# EasyEDA schematic PCB_MINI_FB_ACS_V1.json
TITLE: Sheet_1; REV: 1.0; Date: 2022-08-13; Sheet: 1/1; Drawn By: fuzzy2; Company: Your Company
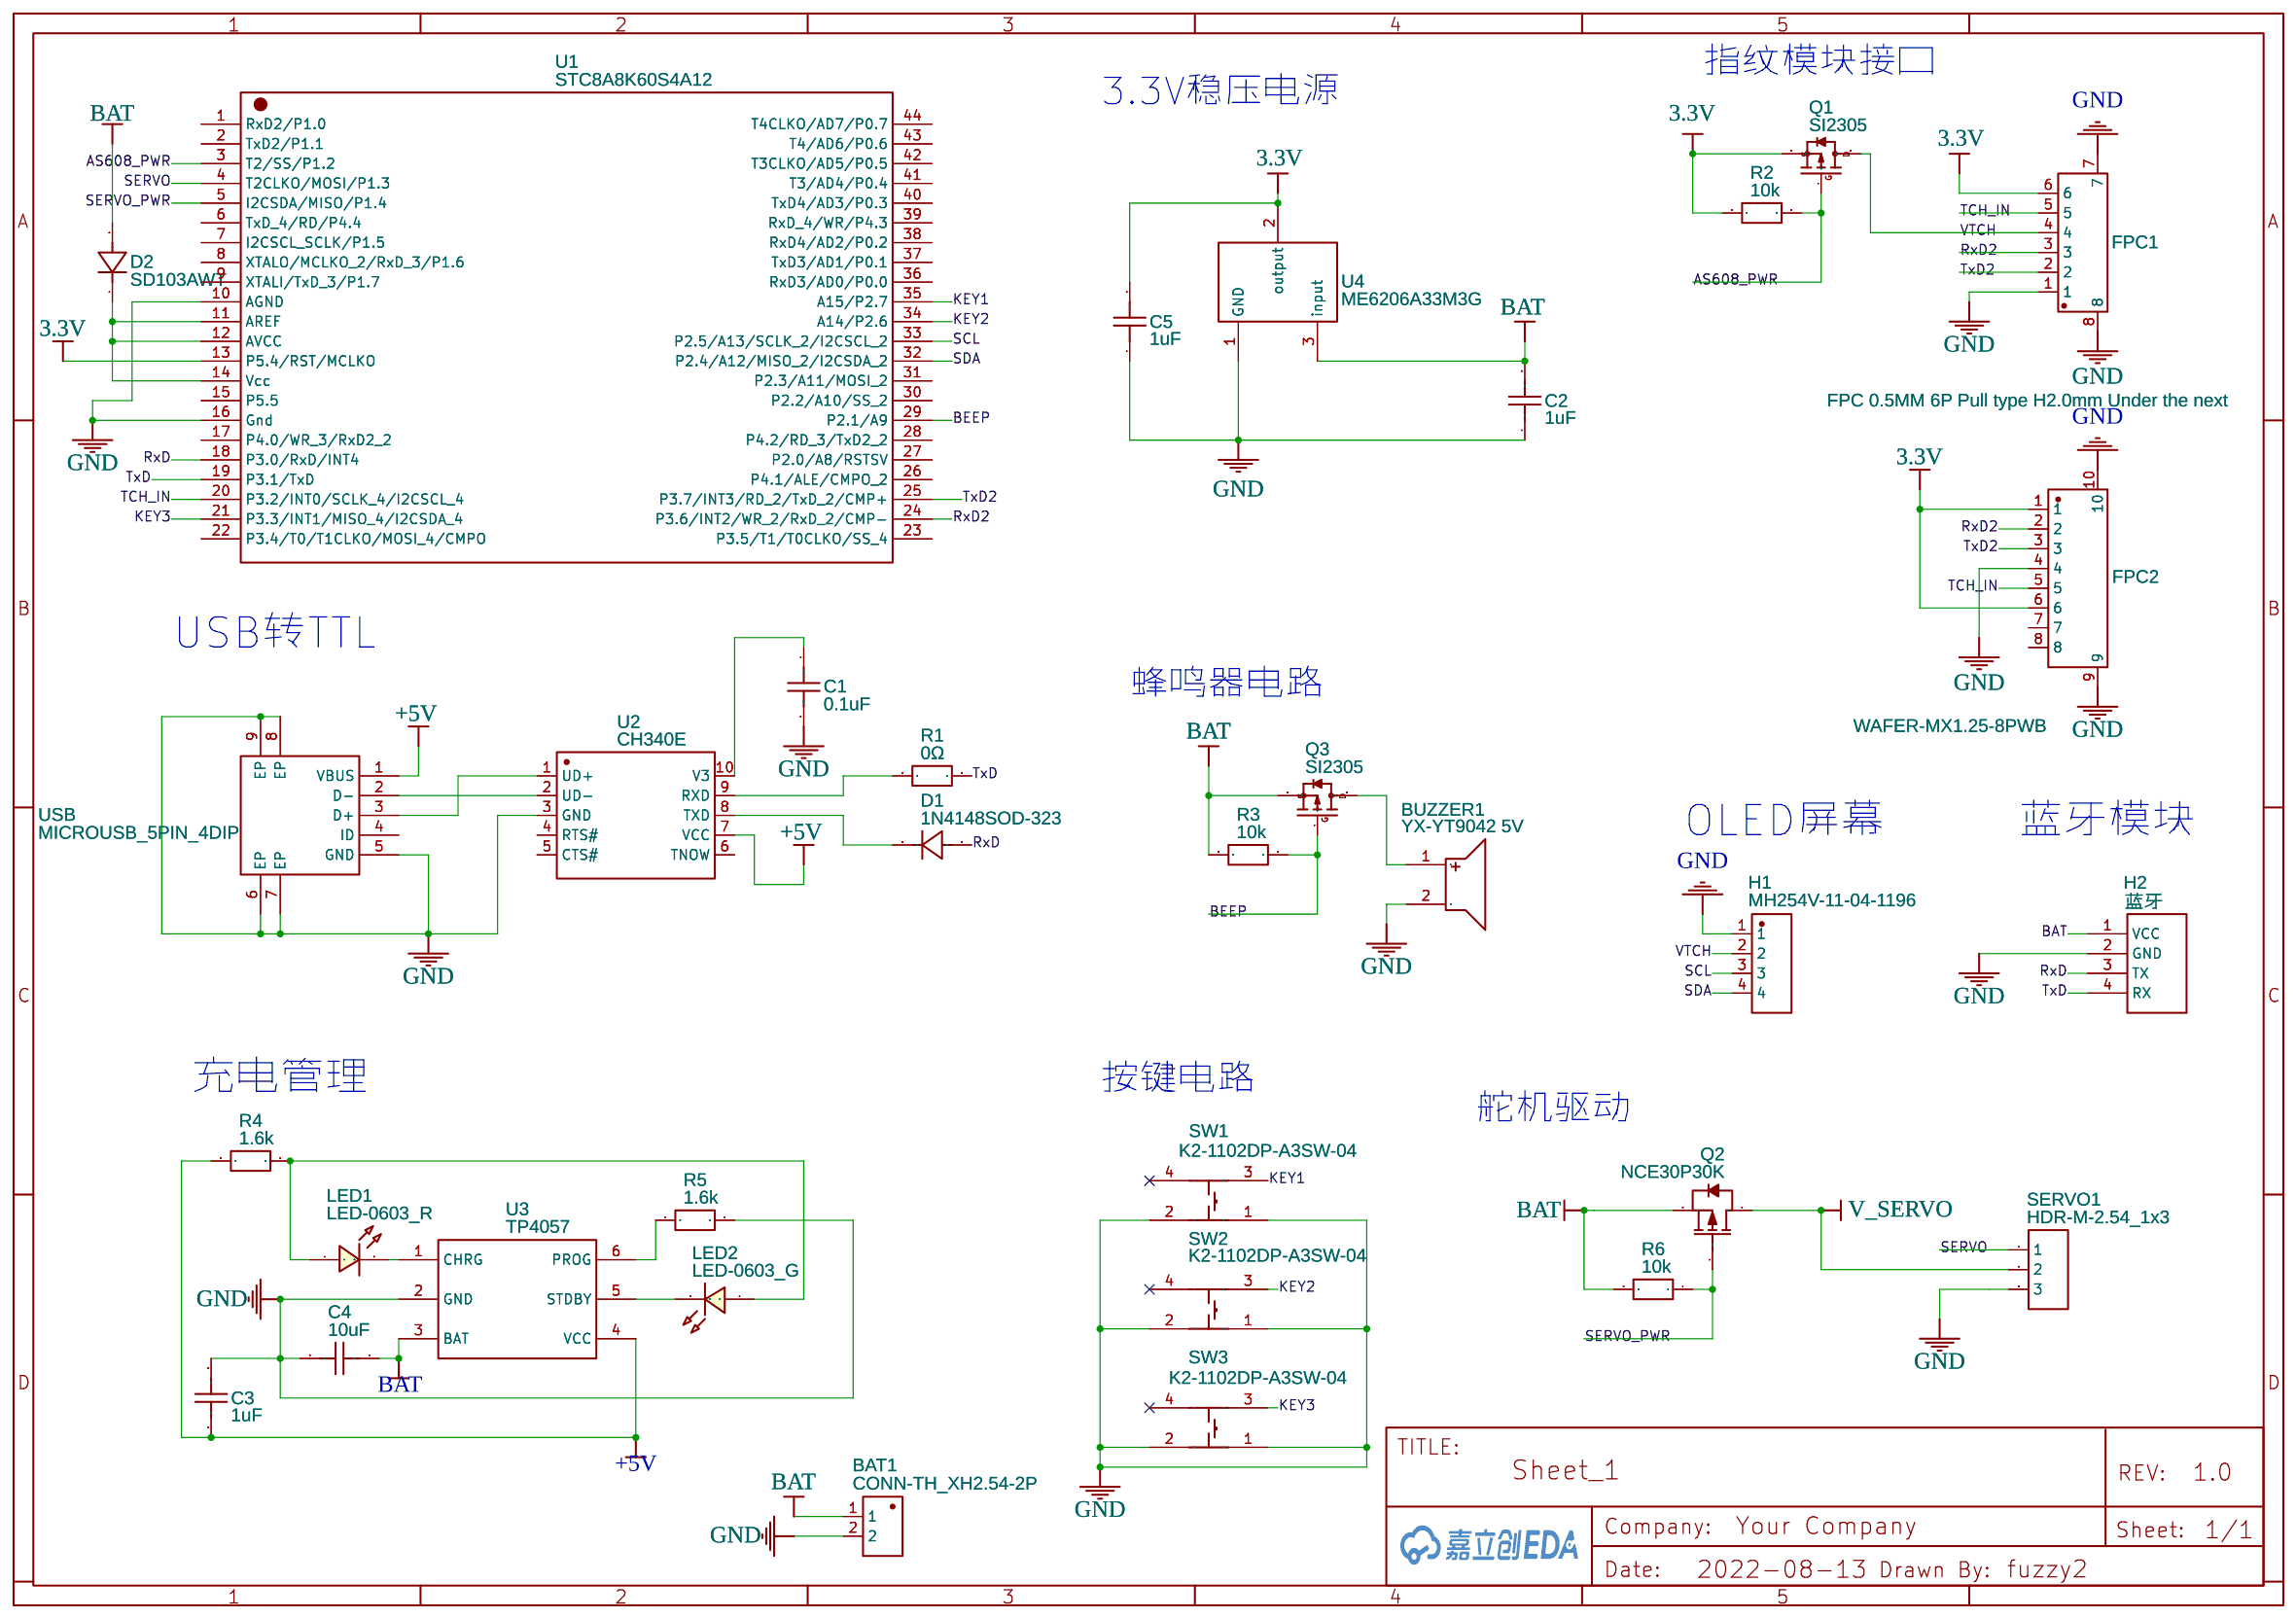
[diagram p0: schematic sheet]

## Parts
BAT1  CONN-TH_XH2.54-2P  [CONN-TH_XH2.54-2P]
BUZZER1  YX-YT9042 5V  [BUZ-TH_BD9.0-P5.00-D0.6-FD]
C1  0.1uF  [C0603]
C2  1uF  [C0603]
C3  1uF  [C0603]
C4  10uF  [C0603]
C5  1uF  [C0603]
D1  1N4148SOD-323  [SOD-323_L1.7-W1.3-LS2.5-RD]
D2  SD103AWT  [SOD-523_L1.2-W0.8-LS1.6-RD]
FPC1  FPC 0.5MM 6P Pull type H2.0mm Under the next  [FPC-SMD_P0.50-6P_LSSJ-H2.0-6P]
FPC2  WAFER-MX1.25-8PWB  [CONN-SMD_8P-P1.25_XUNPU_WAFER-MX1.25-8PWB]
H1  MH254V-11-04-1196  [HDR-TH_4P-P2.54-V-M]
H2  蓝牙  [DIP-1X4P2.54]
LED1  LED-0603_R  [LED0603_RED]
LED2  LED-0603_G  [LED0603_GREEN]
Q1  SI2305  [SOT-23-3_L2.9-W1.3-P1.90-LS2.4-BR]
Q2  NCE30P30K  [TO-252-2_L6.6-W6.1-P4.57-LS9.9-TL-CW]
Q3  SI2305  [SOT-23-3_L2.9-W1.3-P1.90-LS2.4-BR]
R1  0Ω  [R0603]
R2  10k  [R0603]
R3  10k  [R0603]
R4  1.6k  [R0603]
R5  1.6k  [R0603]
R6  10k  [R0603]
SERVO1  HDR-M-2.54_1x3  [HDR-M-2.54_1X3]
SW1  K2-1102DP-A3SW-04  [KEY-TH_4P-L6.0-W6.0-P4.50]
SW2  K2-1102DP-A3SW-04  [KEY-TH_4P-L6.0-W6.0-P4.50]
SW3  K2-1102DP-A3SW-04  [KEY-TH_4P-L6.0-W6.0-P4.50]
U1  STC8A8K60S4A12  [LQFP-44_L10.0-W10.0-P0.80-LS12.0-BL]
U2  CH340E  [MSOP-10_L3.0-W3.0-P0.50-LS5.0-BL]
U3  TP4057  [SOT-23-6_L2.9-W1.6-P0.95-LS2.8-BR]
U4  ME6206A33M3G  [ME6206A33M3G SOT-23(SOT-23-3)]
USB  MICROUSB_5PIN_4DIP  [MICRO-USB-SMD_U254-051N-4BH806]

## Library data of the parts
BAT1 = CONN-TH_XH2.54-2P: Supplier: LCSC; Supplier Part: C9900012767; Manufacturer: null; Manufacturer Part: HX25037-2A; JLCPCB Part Class: Extended Part; Contributor: gxxa622
BUZZER1 = YX-YT9042 5V: Supplier: LCSC; Supplier Part: C781848; Manufacturer: YUEXIN; Manufacturer Part: YX-YT9042 5v; Contributor: LCSC; JLCPCB Part Class: Extended Part
C1 = 0603BB104K500NGT: Supplier: LCSC; Supplier Part: C2168571; Manufacturer: Knowles(楼氏); Contributor: LCSC; JLCPCB Part Class: Extended Part
C2 C3 C5 = CL10A105KP8NNWC: Supplier: LCSC; Supplier Part: C307456; Manufacturer: Samsung Electro-Mechanics; Contributor: LCSC; JLCPCB Part Class: Extended Part
C4 = CL10A106MA8NRNC: Supplier: LCSC; Manufacturer: SAMSUNG; Supplier Part: C96446; JLCPCB Part Class: Extended Part
D1 = 1N4148SOD-323: Supplier: LCSC; Supplier Part: C2972761; Manufacturer: JKSEMI(金开盛); JLCPCB Part Class: Extended Part; Contributor: lcsc
D2 = SD103AWT: Supplier: LCSC; Supplier Part: C840750; Manufacturer: MDD（Microdiode Electronics）; Contributor: LCSC; JLCPCB Part Class: Extended Part
FPC1 = FPC 0.5MM 6P Pull type H2.0mm Under the next: Supplier: LCSC; Manufacturer: ReliaPro; Supplier Part: C11048; JLCPCB Part Class: Extended Part
FPC2 = WAFER-MX1.25-8PWB: Supplier: LCSC; Supplier Part: C3029365; Manufacturer: XUNPU(讯普); link: https://atta.szlcsc.com/upload/public/pdf/source/20220527/5ACBB683E384B6AD06743F272F933620.pdf; Contributor: lcsc
H1 = MH254V-11-04-1196: Supplier: LCSC; Supplier Part: C3015083; Manufacturer: XFCN(台湾兴飞); link: https://atta.szlcsc.com/upload/public/pdf/source/20220518/54992A1A2DF1C7E5202B51C2B9A2DABB.pdf; Contributor: lcsc
H2 = 蓝牙: Manufacturer: Ckmtw; Manufacturer Part: 220S-1*4P H=8.5MM Ytype Gold-plated; Contributor: RovinceZh; Supplier Part: C124413
LED1 = LED-0603_R: Manufacturer: EVERLIGHT(台湾亿光); Manufacturer Part: 19-217/R6C-AL1M2VY/3T; Supplier Part: C72044; Supplier: LCSC; Contributor: LCEDA_01
LED2 = LED-0603_G: Manufacturer: EVERLIGHT(台湾亿光); Manufacturer Part: 19-217/GHC-YR1S2/3T; Supplier Part: C72043; Supplier: LCSC; Contributor: LCEDA_Lib
Q1 Q3 = SI2305: Supplier: LCSC; Manufacturer: Hottech; Contributor: LCSC; Supplier Part: C181088; JLCPCB Part Class: Extended Part
Q2 = NCE30P30K: Supplier: LCSC; Manufacturer: Ncepower; Contributor: LCSC; Supplier Part: C130106; JLCPCB Part Class: Extended Part
R1 = CSRF0603FT2L50: Supplier: LCSC; Supplier Part: C106974; Manufacturer: Stackpole Elec; Resistance (Ohms): 0.0025; Contributor: LCSC; JLCPCB Part Class: Extended Part
R2 R3 R6 = R_0603_EU: Supplier Part: C25197; Supplier: LCSC; Contributor: LCEDA_Lib; Manufacturer Part: 0603WAF510KT5E; Manufacturer: UniOhm
R4 R5 = R_0603_EU: Supplier Part: C325743; Supplier: LCSC; Contributor: LCEDA_Lib; Manufacturer Part: RMC060331.6K1%N; Manufacturer: Tyohm
SERVO1 = HDR-M-2.54_1x3: Supplier Part: C180248; Supplier: LCSC; Contributor: LCEDA_Lib
SW1-SW3 = K2-1102DP-A3SW-04: Supplier: LCSC; Manufacturer: HRO; Contributor: LCSC; Supplier Part: C136685; JLCPCB Part Class: Extended Part
U1 = STC8A8K60S4A12: Supplier: LCSC; Manufacturer: STC; Contributor: LCSC; Supplier Part: C98240; JLCPCB Part Class: Extended Part
U2 = CH340E: Supplier: LCSC; Manufacturer: WCH; Supplier Part: C99652; JLCPCB Part Class: Extended Part; subpart_no: 1
U3 = TP4057: Supplier: LCSC; Manufacturer: TOPPOWER; Supplier Part: C12044; JLCPCB Part Class: Basic Part
U4 = ME6206A33M3G: Supplier: LCSC; Manufacturer: NATLINEAR; Manufacturer Part: LN6206P332MR-G; Supplier Part: C141407; JLCPCB Part Class: Extended Part
USB = MICROUSB_5PIN_4DIP: Supplier: LCSC; Supplier Part: C9900010529; Manufacturer: null; link: https://atta.szlcsc.comnull; JLCPCB Part Class: Extended Part; Contributor: LCSC

## Nets
3.3V: C5.2 FPC1.6 FPC2.1 FPC2.6 Q1.2(S) R2.2 U1.13(P5.4/RST/MCLKO) U4.2(output)
+5V: C3.1 R4.2 U2.7(VCC) U3.4(VCC) USB.1(VBUS)
GND: BAT1.2 BUZZER1.2 C1.2 C2.1 C3.2 C4.1 C5.1 FPC1.1 FPC1.7 FPC1.8 FPC2.4 FPC2.9 FPC2.10 H1.1 H2.2(GND) R5.1 SERVO1.3 SW1.1 SW1.2 SW2.1 SW2.2 SW3.1 SW3.2 U1.10(AGND) U1.16(Gnd) U2.3(GND) U3.2(GND) U4.1(GND) USB.5(GND) USB.6(EP) USB.7(EP) USB.8(EP) USB.9(EP)
AS608_PWR: Q1.1(G) R2.1 U1.3(T2/SS/P1.2)
BAT: BAT1.1 C2.2 C4.2 D2.2(A) H2.1(VCC) Q2.3(S) Q3.2(S) R3.2 R6.2 U3.3(BAT) U4.3(input)
BEEP: Q3.1(G) R3.1 U1.29(P2.1/A9)
KEY1: SW1.3 U1.35(A15/P2.7)
KEY2: SW2.3 U1.34(A14/P2.6)
KEY3: SW3.3 U1.21(P3.3/INT1/MISO_4/I2CSDA_4)
RxD: D1.2(A) H2.3(TX) U1.18(P3.0/RxD/INT4)
RxD2: FPC1.3 FPC2.2 U1.24(P3.6/INT2/WR_2/RxD_2/CMP-)
SCL: H1.3 U1.33(P2.5/A13/SCLK_2/I2CSCL_2)
SDA: H1.4 U1.32(P2.4/A12/MISO_2/I2CSDA_2)
SERVO: SERVO1.1 U1.4(T2CLKO/MOSI/P1.3)
SERVO_PWR: Q2.1(G) R6.1 U1.5(I2CSDA/MISO/P1.4)
TCH_IN: FPC1.5 FPC2.5 U1.20(P3.2/INT0/SCLK_4/I2CSCL_4)
TxD: H2.4(RX) R1.2 U1.19(P3.1/TxD)
TxD2: FPC1.2 FPC2.3 U1.25(P3.7/INT3/RD_2/TxD_2/CMP+)
V_SERVO: Q2.2(D) SERVO1.2
VTCH: FPC1.4 H1.2 Q1.3(D)
Net-(BUZZER1-1): BUZZER1.1 Q3.3(D)
Net-(C1-1): C1.1 U2.10(V3)
Net-(D1-1): D1.1(K) U2.8(TXD)
Net-(D2-1): D2.1(K) U1.11(AREF) U1.12(AVCC) U1.14(Vcc)
Net-(LED1-1): LED1.1 LED2.1 R4.1
Net-(LED1-2): LED1.2 U3.1(CHRG)
Net-(LED2-2): LED2.2 U3.5(STDBY)
Net-(R1-1): R1.1 U2.9(RXD)
Net-(R5-2): R5.2 U3.6(PROG)
Net-(U2-1): U2.1(UD+) USB.3(D+)
Net-(U2-2): U2.2(UD-) USB.2(D-)

Not connected (* = marked no-connect by the designer): FPC2 7 8; SW1 4*; SW2 4*; SW3 4*; U1 1(RxD2/P1.0) 2(TxD2/P1.1) 6(TxD_4/RD/P4.4) 7(I2CSCL_SCLK/P1.5) 8(XTALO/MCLKO_2/RxD_3/P1.6) 9(XTALI/TxD_3/P1.7) 15(P5.5) 17(P4.0/WR_3/RxD2_2) 22(P3.4/T0/T1CLKO/MOSI_4/CMPO) 23(P3.5/T1/T0CLKO/SS_4) 26(P4.1/ALE/CMPO_2) 27(P2.0/A8/RSTSV) 28(P4.2/RD_3/TxD2_2) 30(P2.2/A10/SS_2) 31(P2.3/A11/MOSI_2) 36(RxD3/AD0/P0.0) 37(TxD3/AD1/P0.1) 38(RxD4/AD2/P0.2) 39(RxD_4/WR/P4.3) 40(TxD4/AD3/P0.3) 41(T3/AD4/P0.4) 42(T3CLKO/AD5/P0.5) 43(T4/AD6/P0.6) 44(T4CLKO/AD7/P0.7); U2 4(RTS#) 5(CTS#) 6(TNOW); USB 4(ID)

## Notes on the sheet
- 指纹模块接口
- 3.3V稳压电源
- USB转TTL
- 蜂鸣器电路
- OLED屏幕
- 蓝牙模块
- 充电管理
- 按键电路
- 舵机驱动
